# EAGLE design Shield (EAGLE 9.6.0)
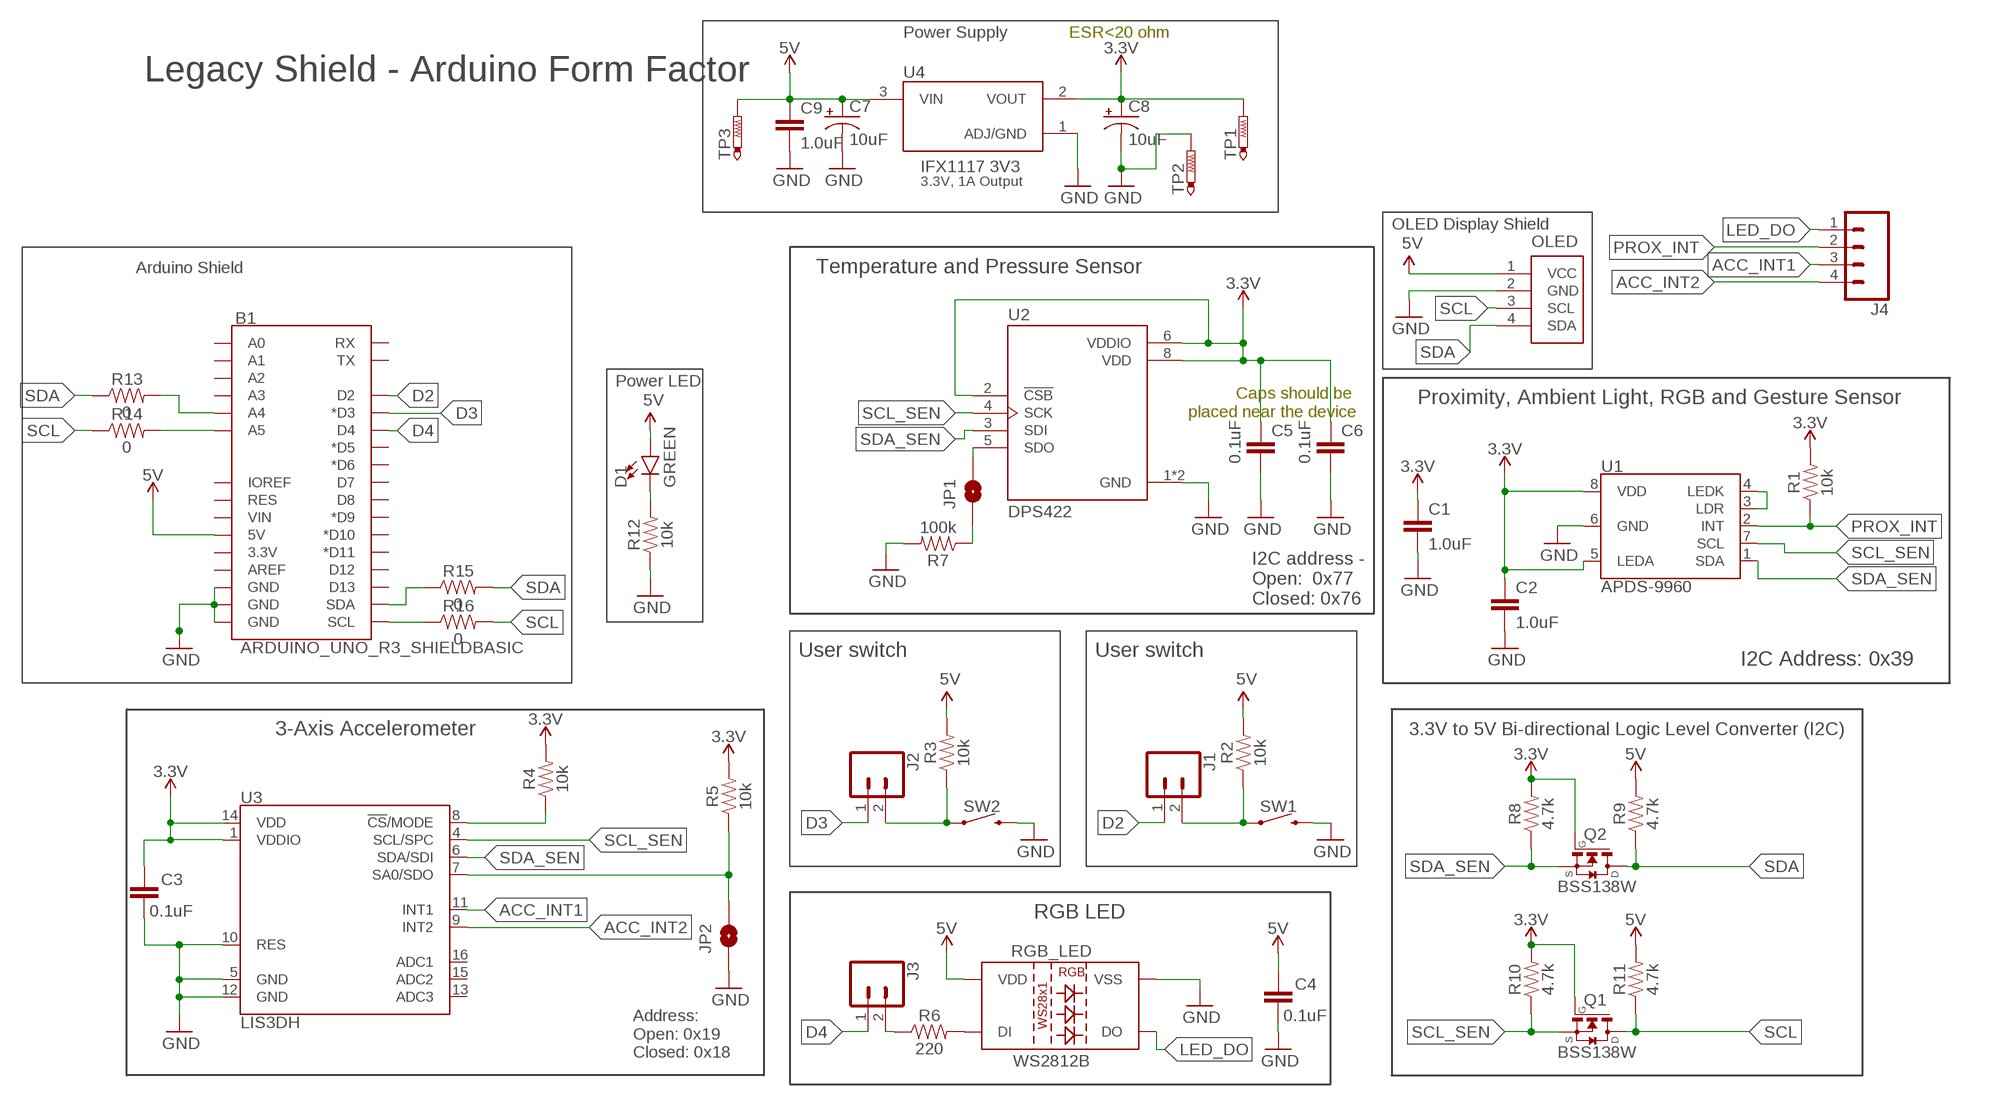
[diagram p0: schematic, sheet 1]

## Parts
B1  ARDUINO_UNO_R3_SHIELDBASIC  [UNO_R3_SHIELD]
C1  1.0uF  1.0UF-16V-10%(0603)  [0603-CAP]
C2  1.0uF  1.0UF-16V-10%(0603)  [0603-CAP]
C3  0.1uF  0.1UF-0603-25V-(+80/-20%)  [0603]
C4  0.1uF  0.1UF-0603-25V-(+80/-20%)  [0603]
C5  0.1uF  0.1UF-0603-25V-(+80/-20%)  [0603]
C6  0.1uF  0.1UF-0603-25V-(+80/-20%)  [0603]
C7  10uF  10UF-POLAR-EIA3528-20V-10%(TANT)  [EIA3528]
C8  10uF  10UF-POLAR-EIA3528-20V-10%(TANT)  [EIA3528]
C9  1.0uF  1.0UF-16V-10%(0603)  [0603-CAP]
D1  GREEN  LED-GREEN1206  [LED-1206]
J1  CONN_02  [1X02]
J2  CONN_02  [1X02]
J3  CONN_02  [1X02]
J4  CONN_04  [1X04]
JP1  JUMPER-SMT_2_NO_SILK  [SMT-JUMPER_2_NO_SILK]
JP2  JUMPER-SMT_2_NO_SILK  [SMT-JUMPER_2_NO_SILK]
OLED  OLED_4_PIN  [OLED_4PIN]
Q1  BSS138W  [SOT323-R]
Q2  BSS138W  [SOT323-R]
R1  10k  10KOHM-0603-1/10W-1%  [0603]
R2  10k  10KOHM-0603-1/10W-1%  [0603]
R3  10k  10KOHM-0603-1/10W-1%  [0603]
R4  10k  10KOHM-0603-1/10W-1%  [0603]
R5  10k  10KOHM-0603-1/10W-1%  [0603]
R6  220  220OHM-0603-1/10W-1%  [0603]
R7  100k  100KOHM-0603-1/10W-1%  [0603]
R8  4.7k  4.7KOHM-0603-1/10W-1%  [0603]
R9  4.7k  4.7KOHM-0603-1/10W-1%  [0603]
R10  4.7k  4.7KOHM-0603-1/10W-1%  [0603]
R11  4.7k  4.7KOHM-0603-1/10W-1%  [0603]
R12  10k  10KOHM-0603-1/10W-1%  [0603]
R13  0  0OHM-0603-1/10W-5%  [0603]
R14  0  0OHM-0603-1/10W-5%  [0603]
R15  0  0OHM-0603-1/10W-5%  [0603]
R16  0  0OHM-0603-1/10W-5%  [0603]
RGB_LED  WS2812B  [WS2812B]
SW1  MOMENTARY-SWITCH-SPST-PTH-6.0MM  [TACTILE_SWITCH_PTH_6.0MM]
SW2  MOMENTARY-SWITCH-SPST-PTH-6.0MM  [TACTILE_SWITCH_PTH_6.0MM]
TP1  PTR1TP08R  [TP08R]
TP2  PTR1TP08R  [TP08R]
TP3  PTR1TP08R  [TP08R]
U1  APDS-9960  [APDS-9960]
U2  DPS422  [XDCR_DPS422]
U3  LIS3DH  [LGA-16-3X3]
U4  IFX1117 3V3  AMS1117-3.3  [SOT229P700X180-4N]

## Nets
3.3V: C1.1 C2.1 C3.1 C5.1 C6.1 C8.A(+) Q1.1(G) Q2.1(G) R1.2 R4.2 R5.2 R8.2 R10.2 TP1.TP U1.5(LEDA) U1.8(VDD) U2.2(!CSB) U2.6(VDDIO) U2.8(VDD) U3.1(VDDIO) U3.14(VDD) U4.2(VOUT)
5V: B1.5V C4.1 C7.A(+) C9.1 D1.A OLED.1(VCC) R2.2 R3.2 R9.2 R11.2 RGB_LED.1(VDD) TP3.TP U4.3(VIN)
ACC_INT1: J4.3 U3.11(INT1)
ACC_INT2: J4.4 U3.9(INT2)
D2: B1.D2 J1.1
D3: B1.D3(*D3) J2.1
D4: B1.D4 J3.1
GND: B1.GND@0(GND) B1.GND@1(GND) B1.GND@2(GND) C1.2 C2.2 C3.2 C4.2 C5.2 C6.2 C7.C(-) C8.C(-) C9.2 JP2.1 OLED.2(GND) R7.2 R12.1 RGB_LED.3(VSS) SW1.3 SW2.3 TP2.TP U1.6(GND) U2.1(GND) U2.7(GND) U3.5(GND) U3.10(RES) U3.12(GND) U4.1(ADJ/GND)
LED_DO: J4.1 RGB_LED.2(DO)
N$1: J1.2 R2.1 SW1.1
N$2: J2.2 R3.1 SW2.1
N$3: D1.C R12.2
N$4: JP1.2 U2.5(SDO)
N$5: JP1.1 R7.1
N$6: B1.A4 R13.2
N$7: U1.3(LDR) U1.4(LEDK)
N$8: B1.A5 R14.2
N$9: B1.SDA R15.1
N$10: JP2.2 R5.1 U3.7(SA0/SDO)
N$11: J3.2 R6.1
N$12: B1.SCL R16.1
N$19: R4.1 U3.8(!CS!/MODE)
N$20: R6.2 RGB_LED.4(DI)
PROX_INT: J4.2 R1.1 U1.2(INT)
SCL: OLED.3(SCL) Q1.3(D) R11.1 R14.1 R16.2
SCL_SEN: Q1.2(S) R10.1 U1.7(SCL) U2.4(SCK) U3.4(SCL/SPC)
SDA: OLED.4(SDA) Q2.3(D) R9.1 R13.1 R15.2
SDA_SEN: Q2.2(S) R8.1 U1.1(SDA) U2.3(SDI) U3.6(SDA/SDI)
Unconnected: B1.3.3V B1.A0 B1.A1 B1.A2 B1.A3 B1.AREF B1.D5(*D5) B1.D6(*D6) B1.D7 B1.D8 B1.D9(*D9) B1.D10(*D10) B1.D11(*D11) B1.D12 B1.D13 B1.IOREF B1.RES B1.RX B1.TX B1.VIN U3.13(ADC3) U3.15(ADC2) U3.16(ADC1)

## Notes on the sheet
- Power Supply | ESR<20 ohm
- Legacy Shield - Arduino Form Factor
- 3.3V, 1A Output
- OLED Display Shield
- Arduino Shield | Temperature and Pressure Sensor
- Power LED
- Caps should be 
  placed near the device
- Proximity, Ambient Light, RGB and Gesture Sensor
- I2C address -
  Open:  0x77
  Closed: 0x76
- User switch | User switch
- I2C Address: 0x39
- 3-Axis Accelerometer | 3.3V to 5V Bi-directional Logic Level Converter (I2C)
- RGB LED
- Address:
  Open: 0x19
  Closed: 0x18

## Library data of the parts
B1 = SparkFun-Boards:ARDUINO_UNO_R3_SHIELD: Arduino R3 Shield Footprint Shield form compatible with the Arduino Uno R3. SparkFun Products: MG2639 Cellular Shield <https://www.sparkfun.com/products/13120> MIDI Shield <https://www.sparkfun.com/products/12898> R3 Stackable Headers Kit <https://www.sparkfun.com/products/11417>
C1 C2 C9 = SparkFun-Capacitors:1.0UF-16V-10%(0603): CAP-00868; PROD_ID: CAP-00868
C3-C6 = SparkFun-Capacitors:0.1UF: 0.1µF ceramic capacitors A capacitor is a passive two-terminal electrical component used to store electrical energy temporarily in an electric field.; PROD_ID: CAP-00810
C7 C8 = SparkFun-Capacitors:10UF-POLAR: 10.0µF polarized capacitors A capacitor is a passive two-terminal electrical component used to store electrical energy temporarily in an electric field.; PROD_ID: CAP-08063
D1 = SparkFun-LED:LED-GREEN: Green SMD LED Used in manufacturing of various products at SparkFun Packages: 0603 - SMD 0603 package [Product Link] <http://www.futureelectronics.com/en/technologies/semiconductors/optoelectronics/leds/Pages/9894312-LTST-C190GKT.aspx?CrossPart=HSMG-C190&IM=0> LilyPad 1206 - SMD1206 LilyPad package [Product Link] <http://www.futureelectronics.com/en/Technologies/Product.aspx?ProductID=IN150NGHARVATEKCORPORATION2049943&IM=0> 1206 - SMD1206 package [Product Link] <http://www.futureelectronics.com/en/technologies/semiconductors/optoelectronics/leds/Pages/8315665-LTST-C150KGKT.aspx?IM=0> 1206 Bottom Mount -SMD 1206 Bottom Mount [Product Link] <http://www.digikey.com/product-detail/en/lite-on-inc/LTST-C230KGKT/160-1456-1-ND/386854> SparkFun Products: Pro Mini 328 -5V <https://www.sparkfun.com/products/821> RedBoard <https://www.sparkfun.com/products/12757> MP3 Trigger <https://www.sparkfun.com/products/13720> Makey Makey <https://www.sparkfun.com/products/11076>; PROD_ID: DIO-00862
J1-J3 = SparkFun-Connectors:CONN_02: Multi connection point. Often used as Generic Header-pin footprint for 0.1 inch spaced/style header connections On any of the 0.1 inch spaced packages, you can populate with these: Break Away Headers - Straight <https://www.sparkfun.com/products/116> (PRT-00116) Break Away Male Headers - Right Angle <https://www.sparkfun.com/products/553> (PRT-00553) Female Headers <https://www.sparkfun.com/products/115> (PRT-00115) Break Away Headers - Machine Pin <https://www.sparkfun.com/products/117> (PRT-00117) Break Away Female Headers - Swiss Machine Pin <https://www.sparkfun.com/products/743> (PRT-00743) For SCREWTERMINALS and SPRING TERMINALS visit here: Screw Terimnals on SparkFun.com <https://www.sparkfun.com/search/results?term=Screw+Terminals> (5mm/3.5mm/2.54mm spacing) This device is also useful as a general connection point to wire up your design to another part of your project. Our various solder wires solder well into these plated through hole pads. Hook-Up Wire - Assortment (Stranded, 22 AWG) <https://www.sparkfun.com/products/11375> (PRT-11375) Hook-Up Wire - Assortment (Solid Core, 22 AWG) <https://www.sparkfun.com/products/11367> (PRT-11367) View the entire wire category on our website here <https://www.sparkfun.com/categories/141> Special notes: Molex polarized connector foot print use with: PRT-08233 with associated crimp pins and housings. 2.54_SCREWTERM for use with PRT-10571. 3.5mm Screw Terminal footprints for PRT-08084 5mm Screw Terminal footprints for use with PRT-08432
J4 = SparkFun-Connectors:CONN_04: Multi connection point. Often used as Generic Header-pin footprint for 0.1 inch spaced/style header connections On any of the 0.1 inch spaced packages, you can populate with these: Break Away Headers - Straight <https://www.sparkfun.com/products/116> (PRT-00116) Break Away Male Headers - Right Angle <https://www.sparkfun.com/products/553> (PRT-00553) Female Headers <https://www.sparkfun.com/products/115> (PRT-00115) Break Away Headers - Machine Pin <https://www.sparkfun.com/products/117> (PRT-00117) Break Away Female Headers - Swiss Machine Pin <https://www.sparkfun.com/products/743> (PRT-00743) For SCREWTERMINALS and SPRING TERMINALS visit here: Screw Terimnals on SparkFun.com <https://www.sparkfun.com/search/results?term=Screw+Terminals> (5mm/3.5mm/2.54mm spacing) This device is also useful as a general connection point to wire up your design to another part of your project. Our various solder wires solder well into these plated through hole pads. Hook-Up Wire - Assortment (Stranded, 22 AWG) <https://www.sparkfun.com/products/11375> (PRT-11375) Hook-Up Wire - Assortment (Solid Core, 22 AWG) <https://www.sparkfun.com/products/11367> (PRT-11367) View the entire wire category on our website here <https://www.sparkfun.com/categories/141> Special notes: Molex polarized connector foot print use with SKU : PRT-08231 with associated crimp pins and housings. 1MM SMD Version SKU: PRT-10208; PROD_ID: CONN-09696
JP1 JP2 = SparkFun-Jumpers:JUMPER-SMT_2_NO: Normally open jumper This jumper has two pads in close proximity to each other. Apply solder to close the connection. Round pads are easier to solder for beginners, but are a lot larger. SparkFun Product that uses the round pads: SparkFun EL Sequencer <https://www.sparkfun.com/products/12781>
OLED = OLED_4_pin:OLED_4_PIN: This is a 4-pin SSD1306 OLED display module.; DESCRIPTION: 0.96 Inch I2C/IIC 4pin OLED Display Module; MF: Adafruit Industries; PURCHASE_LINK: https://robu.in/product/0-96-inch-i2c-iic-oled-lcd-module-4pin-with-vcc-gnd-blue/
Q1 Q2 = BSS138W:BSS138W: N-Channel MOSFET; DESCRIPTION: N-Channel 60V 280mA (Ta) 500mW (Ta) Surface Mount PG-SOT323-3; DIGI-KEY_PART_NUMBER: BSS138WH6327XTSA1CT-ND; DIGI-KEY_PURCHASE_URL: https://www.digikey.in/product-detail/en/infineon-technologies/BSS138WH6327XTSA1/BSS138WH6327XTSA1CT-ND/5410000; MF: Infineon Technologies; MP: BSS138W; PACKAGE: SOT-323
R1-R5 R12 = SparkFun-Resistors:10KOHM: 10kΩ resistor A resistor is a passive two-terminal electrical component that implements electrical resistance as a circuit element. Resistors act to reduce current flow, and, at the same time, act to lower voltage levels within circuits. - Wikipedia; PROD_ID: RES-00824
R6 = SparkFun-Resistors:220OHM: 220Ω resistor A resistor is a passive two-terminal electrical component that implements electrical resistance as a circuit element. Resistors act to reduce current flow, and, at the same time, act to lower voltage levels within circuits. - Wikipedia; PROD_ID: RES-07861
R7 = SparkFun-Resistors:100KOHM: 100kΩ resistor A resistor is a passive two-terminal electrical component that implements electrical resistance as a circuit element. Resistors act to reduce current flow, and, at the same time, act to lower voltage levels within circuits. - Wikipedia; PROD_ID: RES-07828
R8-R11 = SparkFun-Resistors:4.7KOHM: 4.7kΩ resistor A resistor is a passive two-terminal electrical component that implements electrical resistance as a circuit element. Resistors act to reduce current flow, and, at the same time, act to lower voltage levels within circuits. - Wikipedia; PROD_ID: RES-07857
R13-R16 = SparkFun-Resistors:0OHM: 0Ω resistor A resistor is a passive two-terminal electrical component that implements electrical resistance as a circuit element. Resistors act to reduce current flow, and, at the same time, act to lower voltage levels within circuits. - Wikipedia; PROD_ID: RES-08609
RGB_LED = SparkFun-LED:WS2812B: WS2812B SMD addressable RGB LED 5x5mm SMD LED with built-in controller IC. Color: Red/Green/Blue mC Rating: RGB: 390, 660, 180 mcd Forward Voltage: RGB: 2.0, 3.0, 3.0 V Packages:WS2812B SparkFun Products: Blynk Board - ESP8266 <https://www.sparkfun.com/products/13794>; PROD_ID: DIO-12503
SW1 SW2 = SparkFun-Switches:MOMENTARY-SWITCH-SPST: Momentary Switch (Pushbutton) - SPST Normally-open (NO) SPST momentary switches (buttons, pushbuttons). Variants PTH-12MM - 12mm square, through-hole Momentary Pushbutton Switch - 12mm Square <https://www.sparkfun.com/products/9190> (COM-09190) PTH-6.0MM, PTH-6.0MM-KIT - 6.0mm square, through-hole Mini Pushbutton Switch <https://www.sparkfun.com/products/97> (COM-00097) KIT package intended for soldering kit's - only one side of pads' copper is exposed. PTH-RIGHT-ANGLE-KIT - Right-angle, through-hole Right Angle Tactile Button <https://www.sparkfun.com/products/10791> - Used on SparkFun BigTime Watch Kit <https://www.sparkfun.com/products/11734> SMD-12MM - 12mm square, surface-mount Tactile Button - SMD (12mm) <https://www.sparkfun.com/products/12993> (COM-12993) Used on SparkFun PicoBoard <https://www.sparkfun.com/products/11888> SMD-4.5MM - 4.5mm Square Trackball Switch Used on SparkFun Blackberry Trackballer Breakout <https://www.sparkfun.com/products/13169> SMD-4.6MMX2.8MM - 4.60mm x 2.80mm, surface mount Used on SparkFun SAMD21 Mini Breakout <https://www.sparkfun.com/products/13664> SMD-5.2MM, SMD-5.2-REDUNDANT - 5.2mm square, surface-mount Mini Pushbutton Switch - SMD <https://www.sparkfun.com/products/8720> (COM-08720) Used on Arduino Pro Mini <https://www.sparkfun.com/products/11114> REDUNDANT package connects both switch circuits together SMD-6.0X3.5MM - 6.0 x 3.5mm, surface mount Momentary Reset Switch SMD <https://www.sparkfun.com/products/8229> (COM-08229) SMD-6.2MM-TALL - 6.2mm square, surface mount Tactile Button - SMD (6mm) <https://www.sparkfun.com/products/12992> Used on SparkFun Digital Sandbox <https://www.sparkfun.com/products/12651> SMD-RIGHT-ANGLE - Right-angle, surface mount Used on SparkFun Block for Intel® Edison - Arduino <https://www.sparkfun.com/products/13036>; PROD_ID: SWCH-08441; SF_SKU: COM-00097
TP1-TP3 = testpad:PTR1: TEST PIN
U1 = APDS-9960:APDS-9960: Avago APDS-9960 Digital Proximity, Ambient Light, RGB, and Gesture Sensor. The APDS-9960 offers ambient light and color measuring, proximity detection, and touchless gesture sensing. It features UV and IR blocking filters, four separate diodes sensitive to different directions, and an I2C compatible interface. Datasheet <https://cdn.sparkfun.com/datasheets/Sensors/Proximity/apds9960.pdf> SparkFun Products SparkFun RGB and Gesture Sensor - APDS-9960 <https://www.sparkfun.com/products/12787> (SEN-12787); AVAILABILITY: Unavailable; DESCRIPTION: Digital Ambient Light and Proximity Sensor 8-Pin SMD T/R; DIGI-KEY_PART_NUMBER: 516-3480-1-ND; DIGI-KEY_PURCHASE_LINK: https://www.digikey.in/product-detail/en/broadcom-limited/APDS-9960/516-3480-1-ND/6677150; MF: Broadcom Limited; MP: APDS-9960; PACKAGE: SMD-8 Broadcom; PRICE: None
U2 = DPS422:DPS422: N/A; AVAILABILITY: Unavailable; DESCRIPTION: Pressure Sensor 4.35PSI ~ 17.4PSI _30kPa ~ 120kPa_ Vented Gauge 24 b 8-WLGA; DIGI-KEY_PART_NUMBER: DPS422XTSA1CT-ND; DIGI-KEY_PURCHASE_LINK: https://www.digikey.in/product-detail/en/infineon-technologies/DPS422XTSA1/DPS422XTSA1CT-ND/9384616; MF: Infineon Technologies; MP: DPS422; PACKAGE: WLGA-8 Infineon; PRICE: None
U3 = SparkFun-Sensors:LIS3DH: ST Microelectronics LIS3DH 3-Axis ±2/4/8/16g SPI/I2C Accelerometer The LIS3DH is a three axis MEMS linear accelerometer in the "nano" family. It has a digital I2C/SPI serial interface which makes it ideal for using in embedded applications. The device also features ultra low-power operational modes that allow advanced power saving and smart sleep to wake-up functions, built in detections with interrupts, and auxiliary ADC inputs Datasheet-XXXX <http://www.sparkfun.com/datasheets/Sensors/Accelerometer/LIS3DH.pdf> SparkFun Products SparkFun Triple Axis Accelerometer Breakout - LIS3DH <https://www.sparkfun.com/products/10345> (SEN-XXXXX) Triple Axis Accelerometer - LIS3DH <https://www.sparkfun.com/products/9755> (SEN-XXXXX); PROD_ID: IC-13419; SF_ID: N/A
U4 = AMS1117-3.3:AMS1117-3.3: Sot223/Pkg 1-Amp 3.3-Volt Low Drop Out Voltage Regulatator; AVAILABILITY: Unavailable; DESCRIPTION: IC REG LINEAR 3.3V 1A SOT223-4; DIGI-KEY_PART_NUMBER: IFX1117MEV33HTMA1CT-ND; DIGI-KEY_PURCHASE_URL: https://www.digikey.in/product-detail/en/infineon-technologies/IFX1117MEV33HTMA1/IFX1117MEV33HTMA1CT-ND/3929253; MF: Infineon Technologies; MP: IFX1117; PACKAGE: SOT223-4; PRICE: None

## Board
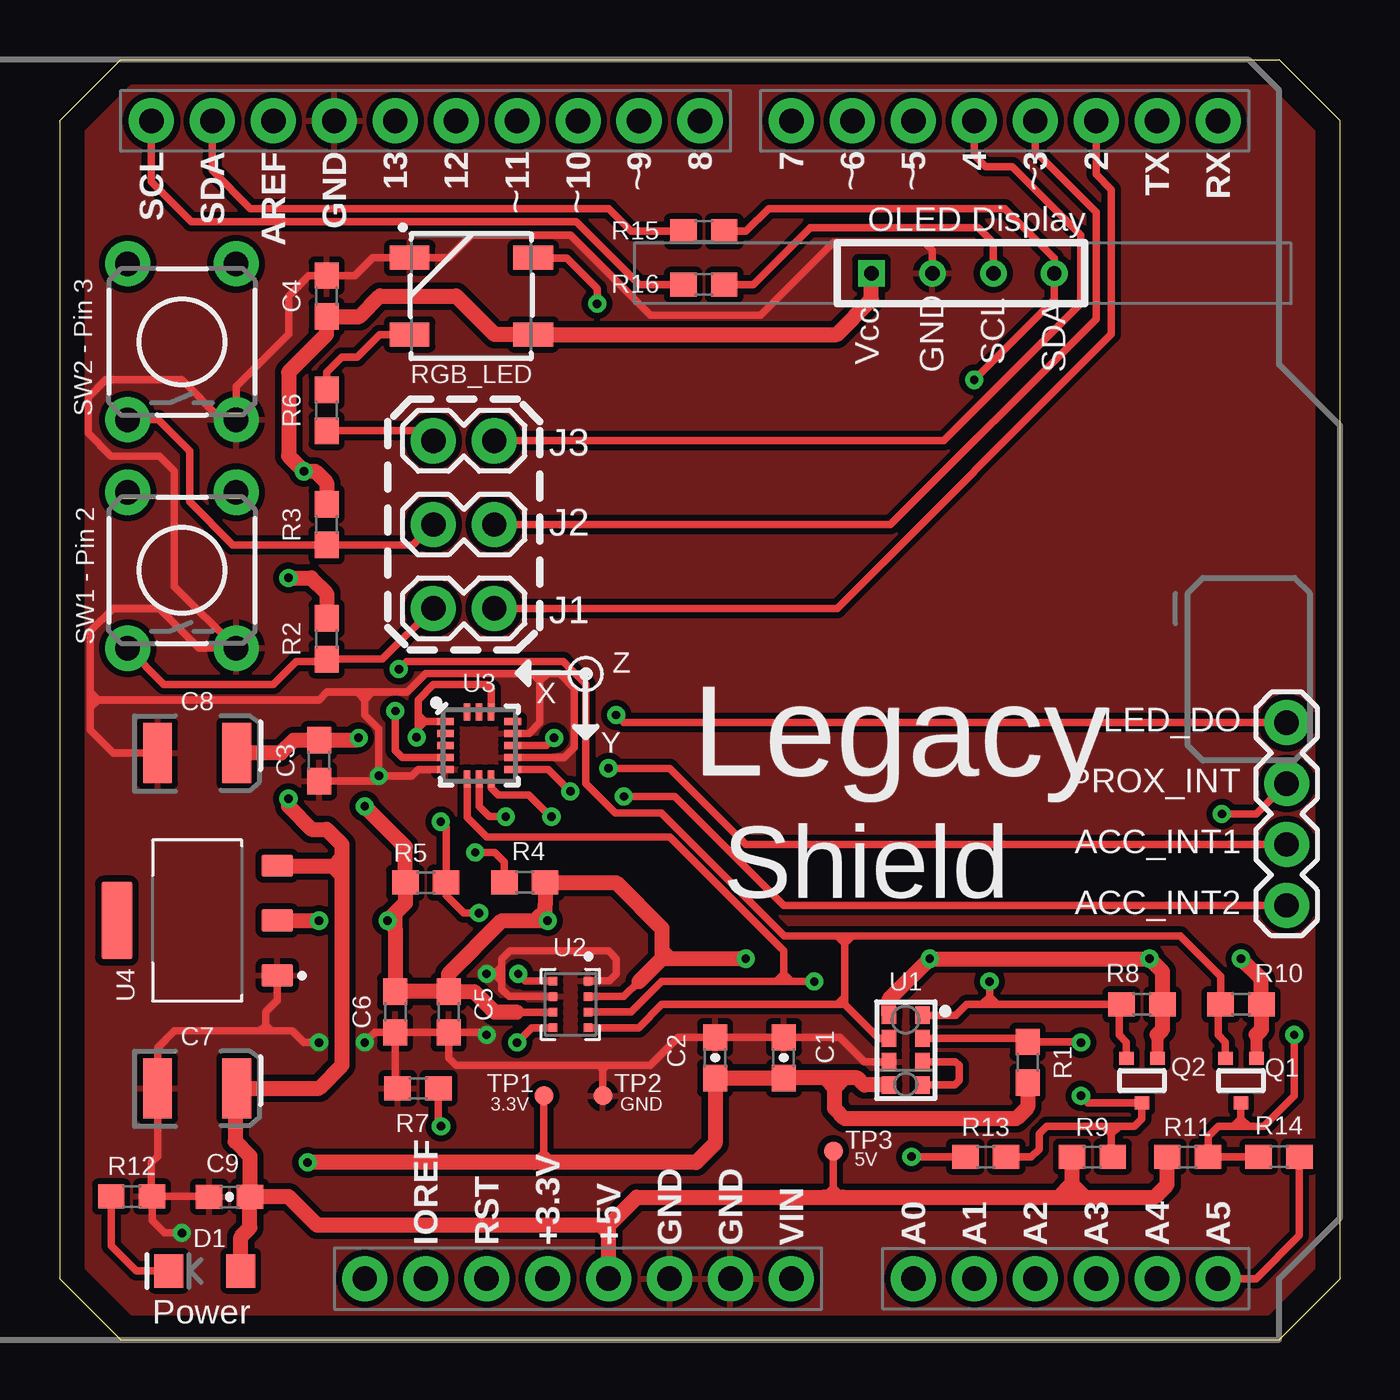
[diagram p1: board, top side]
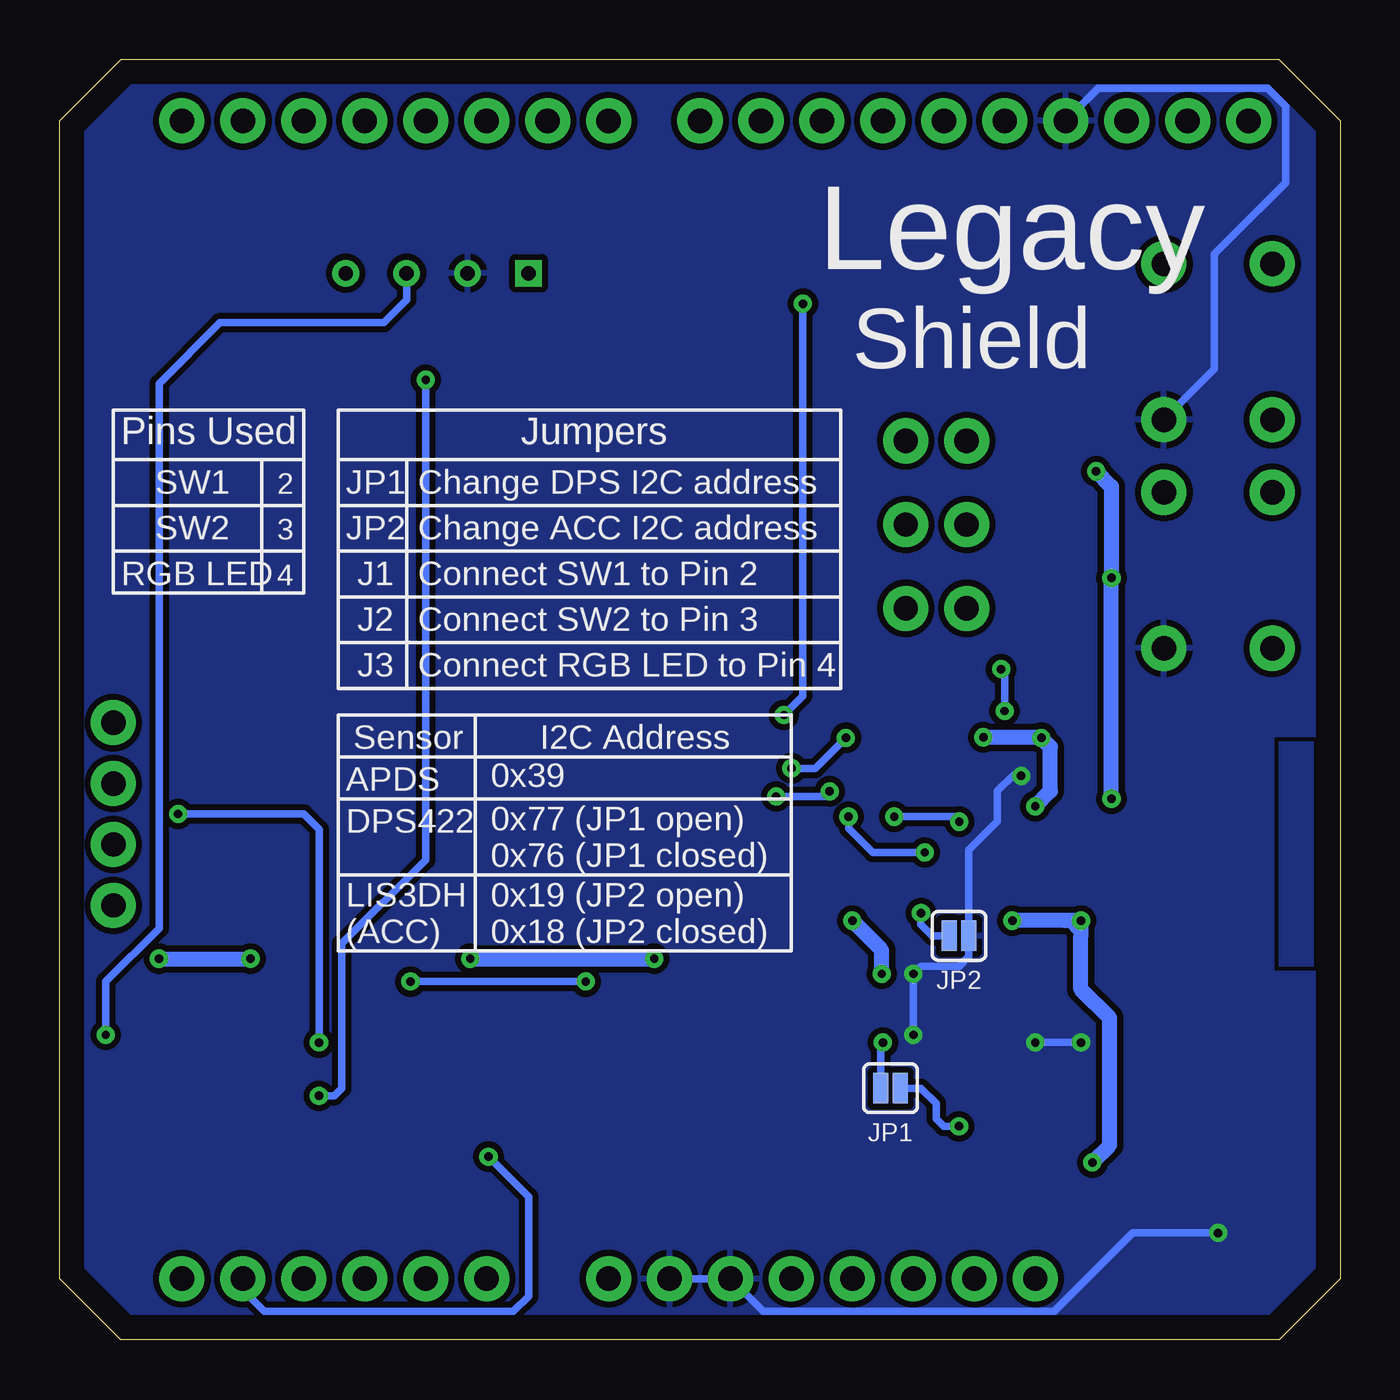
[diagram p2: board, bottom side, seen from below]

Size 53.34 x 53.34 mm. Coordinates in mm from the lower left corner, seen from the top.
Outline: 0,50.8 0,2.54 2.54,0 50.8,0 53.34,2.54 53.34,50.8 50.8,53.34 2.54,53.34 0,50.8
Copper layers (1*16): Top 0.035mm / dielectric 1.5mm / Bottom 0.035mm
Design rules "default *": minimum track width 6mil, minimum drill 0.35mm, track to track 6mil, track to pad 6mil, pad to pad 6mil, via to via 6mil, smd to smd 6mil, copper to edge 40mil, drill to drill 6mil, minimum pad ring 10mil, minimum via ring 8mil, stop-mask expansion 4mil, vias tented up to drill 15mil, thermal gap 10mil

### Footprints (pad centres in the part's own frame; a part is rotated, then mirrored left to right if it is on the bottom)
UNO_R3_SHIELD = drill 1.016 pad 1.88: 3.3V 24.13,-2.54; 5V 24.13,0; A0 24.13,12.7; A1 24.13,15.24; A2 24.13,17.78; A3 24.13,20.32; A4 24.13,22.86; A5 24.13,25.4; AREF -24.13,-13.97; D2 -24.13,20.32; D3 -24.13,17.78; D4 -24.13,15.24; D5 -24.13,12.7; D6 -24.13,10.16; D7 -24.13,7.62; D8 -24.13,3.81; D9 -24.13,1.27; D10 -24.13,-1.27; D11 -24.13,-3.81; D12 -24.13,-6.35; D13 -24.13,-8.89; GND@0 24.13,2.54; GND@1 24.13,5.08; GND@2 -24.13,-11.43; IOREF 24.13,-7.62; NC 24.13,-10.16; RES 24.13,-5.08; RX -24.13,25.4; SCL -24.13,-19.05; SDA -24.13,-16.51; TX -24.13,22.86; VIN 24.13,7.62
0603-CAP = smd 1.1 x 1: 1 -0.85,0; 2 0.85,0
0603 = smd 1.1 x 1: 1 -0.85,0; 2 0.85,0
EIA3528 = smd 1.2 x 2.5: A 1.65,0; C -1.65,0
LED-1206 = smd 1.2 x 1.4: A -1.5,0; C 1.5,0
1X02 = drill 1.016 pad 1.88: 1 0,0; 2 2.54,0
1X04 = drill 1.016 pad 1.88: 1 0,0; 2 2.54,0; 3 5.08,0; 4 7.62,0
SMT-JUMPER_2_NO_SILK = smd 0.635 x 1.27: 1 -0.406,0; 2 0.406,0
OLED_4PIN = drill 0.6 square: 1 -3.81,-1.27 | drill 0.6: 2 -1.27,-1.27; 3 1.27,-1.27; 4 3.81,-1.27
SOT323-R = smd 0.6 x 0.55: 1 -0.65,-0.925; 2 0.65,-0.925; 3 0,0.925
WS2812B = smd 1.651 x 1: 1 2.577,-1.6; 2 2.577,1.6; 3 -2.577,1.6; 4 -2.577,-1.6
TACTILE_SWITCH_PTH_6.0MM = drill 1.016 pad 1.88: 1 -3.251,2.261; 2 3.251,2.261; 3 -3.251,-2.261; 4 3.251,-2.261
TP08R = smd 0.8 x 0.8: TP 0,0
APDS-9960 = smd 0.6 x 0.72: 1 0.7,1.455; 2 0.7,0.485; 3 0.7,-0.485; 4 0.7,-1.455; 5 -0.7,-1.455; 6 -0.7,-0.485; 7 -0.7,0.485; 8 -0.7,1.455
XDCR_DPS422 = smd 0.35 x 0.35: 1 -0.975,0.725; 2 -0.325,0.725; 3 0.325,0.725; 4 0.975,0.725; 5 0.975,-0.725; 6 0.325,-0.725; 7 -0.325,-0.725; 8 -0.975,-0.725
LGA-16-3X3 = smd 0.7 x 0.28: 1 -1.4,1; 2 -1.4,0.5; 3 -1.4,0; 4 -1.4,-0.5; 5 -1.4,-1; 9 1.4,-1; 10 1.4,-0.5; 11 1.4,0; 12 1.4,0.5; 13 1.4,1 | smd 0.28 x 0.7: 6 -0.5,-1.4; 7 0,-1.4; 8 0.5,-1.4; 14 0.5,1.4; 15 0,1.4; 16 -0.5,1.4
SOT229P700X180-4N = smd 0.93 x 1.31: 1 -2.29,-3.345; 2 0,-3.345; 3 2.29,-3.345 | smd 3.24 x 1.31: 4 0,3.345

### Placement (x,y rotation side)
B1  22.86,26.67 270 top
C1  30.16,11.75 90 top
C2  27.3,11.75 90 top
C3  10.79,24.13 270 top
C4  11.11,43.5 90 top
C5  16.19,13.65 270 top
C6  13.97,13.65 270 top
C7  5.71,10.48 0 top
C8  5.71,24.45 0 top
C9  7.06,5.95 180 top
D1  6.03,2.86 180 top
J1  18.1,30.48 180 top
J2  18.1,33.97 180 top
J3  18.1,37.47 180 top
J4  51.12,25.72 270 top
JP1  18.73,10.48 180 bottom
JP2  15.87,16.83 180 bottom
OLED  37.62,45.72 0 top
Q1  49.21,10.79 180 top
Q2  45.09,10.79 180 top
R1  40.32,11.56 270 top
R2  11.11,29.21 90 top
R3  11.11,33.97 90 top
R4  19.37,19.05 0 top
R5  15.24,19.05 180 top
R6  11.11,38.73 90 top
R7  14.92,10.48 180 top
R8  45.09,13.97 0 top
R9  43.02,7.62 180 top
R10  49.21,13.97 0 top
R11  46.99,7.62 180 top
R12  2.98,5.97 180 top
R13  38.58,7.62 180 top
R14  50.8,7.62 0 top
R15  26.83,46.2 0 top
R16  26.83,43.97 0 top
RGB_LED  17.15,43.5 0 top
SW1  5.08,32.07 90 top
SW2  5.08,41.59 90 top
TP1  20.16,10.16 0 top
TP2  22.62,10.16 0 top
TP3  32.23,7.86 0 top
U1  35.24,12.07 0 top
U2  21.27,13.97 270 top
U3  17.46,24.77 0 top
U4  5.71,17.46 90 top

### Tracks (layer width: path | path; a pad name or v marks a point on that pad's centre or on a via)
3.3V  (via drill 0.35)
  Top 0.305: U3.14 17.96,27.12 17.78,27.31 15.56,27.31 14.92,26.67 14.92,26.04 | U2.6 19.06,13.64 19.05,13.65 | U2.2 23.5,14.29 24.13,14.92 | U2.8 19.39,14.95 v19.1,15.24 | 20.22,18.1 19.68,17.57 19.68,17.46 | v14.86,25.11 14.92,25.17 14.92,25.5 | 14.92,25.5 14.92,25.72 | 14.92,25.72 14.92,26.04 | U3.1 15.19,25.77 | 15.19,25.77 14.97,25.77 14.92,25.72 | 15.19,25.77 14.92,26.04 | 15.19,25.77 14.92,25.5 | TP1.TP 20.16,7.78 | 20.16,7.78 20.16,7.46 20.08,7.38 | 19.76,7.38 20.16,7.78 | 20.16,7.78 20.48,7.46 20.48,7.38
  Top 0.508: 45.72,12.7 45.72,11.74 Q2.1 | 49.85,12.7 49.85,11.74 Q1.1
  Top 0.635: 32.28,10.9 31.86,10.9 | 31.86,10.9 C1.1 C2.1 27.3,8.18 26.51,7.38 20.48,7.38 20.08,7.38 19.76,7.38 v10.32,7.38 | R1.2 40.32,9.68 39.85,9.21 32.7,9.21 32.28,9.63 32.28,10.48 | 32.28,10.48 32.28,10.9 | U1.5 33.52,10.61 33.23,10.9 32.7,10.9 | 32.7,10.9 32.28,10.9 | 31.86,10.9 32.28,10.48 | 32.28,10.48 32.7,10.9 | 45.72,12.7 45.93,12.92 R8.2 45.93,15.34 v45.4,15.88 v36.24,15.88 34.54,14.17 U1.8 | 49.85,12.7 50.06,12.92 R10.2 50.06,15.03 v49.21,15.88 | C5.1 17.25,14.5 18.1,13.65 19.05,13.65 | v28.57,15.88 25.4,15.88 | 25.4,15.88 25.08,15.88 | 24.13,14.92 25.08,15.88 | C8.A 9.21,24.45 9.74,24.98 C3.1 12.34,24.98 v12.45,25.08 | C5.1 C6.1 13.97,17.14 | U4.2 v10.79,17.46 | 13.97,17.78 14.39,18.2 R5.2 14.39,20.54 v12.7,22.22 | 13.97,17.78 13.81,17.62 | 13.81,17.62 v13.65,17.46 13.97,17.14 | 13.97,17.14 13.97,17.46 | 13.97,17.46 13.81,17.62 | 13.97,17.46 13.97,17.78 | 25.08,16.19 25.08,17.14 23.18,19.05 R4.2 20.22,18.1 20.22,17.57 v20.32,17.46 19.68,17.46 18.41,17.46 16.19,15.24 C5.1 | 25.08,16.19 25.08,15.88 | 25.08,16.19 25.4,15.88
  Bottom 0.305: 10.79,16.83 11.43,17.46
  Bottom 0.635: v49.21,15.88 v45.4,15.88 | v36.24,15.88 v28.57,15.88 | v13.65,17.46 11.43,17.46 v10.79,17.46 10.79,16.83 10.79,14.61 9.6,13.41 9.6,8.1 v10.32,7.38 | v19.1,15.24 19.1,16.24 v20.32,17.46 | v12.7,22.22 12.07,22.86 12.07,24.7 v12.45,25.08 12.47,25.11 v14.86,25.11
5V  (via drill 0.35)
  Top 0.305: TP3.TP 32.23,6.33 | 32.23,6.33 32.23,5.93 | 32.23,6.33 31.83,5.93 | 32.23,6.33 32.62,5.93
  Top 0.635: B1.5V 22.86,4.45 | 22.86,4.45 22.86,4.76 | 22.86,4.76 22.54,4.76 | 22.86,4.76 24.03,5.93 31.83,5.93 32.23,5.93 32.62,5.93 41.59,5.93 | 22.54,4.76 22.86,4.45 | v9.52,31.75 10.48,31.75 11.11,31.11 R2.2 | R3.2 11.11,35.72 10.64,36.2 v10.16,36.2 9.52,36.83 9.52,40.32 11.11,41.91 C4.1 12.48,42.65 13.34,43.5 16.51,43.5 18.11,41.9 RGB_LED.1 32.37,41.9 33.81,43.34 OLED.1 | v9.52,22.54 9.52,22.22 10.48,21.27 11.11,21.27 11.75,20.64 11.75,20.07 | 11.75,20.07 11.75,19.68 | 11.75,19.68 11.75,19.37 | 11.75,19.37 11.75,11.43 10.79,10.48 C7.A 7.3,10.42 7.3,8.25 7.91,7.64 C9.1 | U4.3 11.43,19.75 | 11.43,19.75 11.68,19.75 11.75,19.68 | 11.43,19.75 11.75,20.07 | 11.43,19.75 11.43,19.68 11.75,19.37 | R11.2 46.14,6.45 45.62,5.93 42.7,5.93 | 41.59,5.93 42.23,5.93 | 42.23,5.93 42.7,5.93 | R9.2 42.17,6.46 | 42.17,6.46 42.17,5.99 42.23,5.93 | 42.7,5.93 42.17,6.46 | 42.17,6.46 42.12,6.46 41.59,5.93 | C9.1 9.52,5.95 10.72,4.76 22.54,4.76 | D1.A 7.53,4.28 7.91,4.66 C9.1
  Bottom 0.635: v9.52,22.54 v9.52,31.75 9.52,35.56 v10.16,36.2
ACC_INT1  (via drill 0.35)
  Top 0.305: J4.3 28.57,20.64 25.4,23.81 v22.86,23.81 | v20.59,25.08 20.27,24.77 U3.11
  Bottom 0.305: v22.86,23.81 21.86,23.81 v20.59,25.08
ACC_INT2  (via drill 0.35)
  Top 0.305: J4.4 30.16,18.1 25.62,22.64 v23.49,22.64 | v21.27,22.85 20.35,23.77 U3.9
  Bottom 0.305: v23.49,22.64 21.48,22.64 v21.27,22.85
D2
  Top 0.305: J1.1 32.38,30.48 43.82,41.91 43.82,47.94 43.18,48.58 B1.D2
D3
  Top 0.305: B1.D3 40.64,49.53 43.18,46.99 43.18,42.55 34.61,33.97 J2.1
D4
  Top 0.305: J3.1 36.83,37.47 42.54,43.18 42.54,46.04 39.69,48.9 38.58,48.9 38.1,49.37 B1.D4
GND  (via drill 0.35)
  Top 0.305: U3.5 14.92,23.77 14.65,23.5 v13.29,23.5 | v13.29,23.5 13.07,23.28 C3.2 | U3.10 21.01,24.27 21.43,24.69 21.43,27.15 20.82,27.76 20.32,27.76 | U3.12 19.55,25.27 20,25.72 20,27.45 | 20.32,27.76 20,27.76 | 20,27.76 19.68,27.76 | 19.68,27.76 15.24,27.76 14.46,26.99 13.02,26.99 | 20,27.45 20,27.76 | 20,27.45 20.32,27.76 | 20,27.45 19.68,27.76 | U2.1 22.88,14.95 23.18,15.24 23.18,15.88 22.86,16.19 18.73,16.19 18.41,15.88 18.41,15.56 | 18.41,15.56 18.41,15.24 | 18.41,15.24 18.41,14.92 | 18.41,14.92 18.41,14.61 18.73,14.29 U2.7 | U1.6 33.51,11.58 32.49,12.6 C1.2 C2.2 25.77,12.6 24.61,11.43 22.78,11.43 | C6.2 C5.2 | R7.2 13.97,10.58 C6.2 | SW2.3 7.34,38.42 | 7.34,38.42 7.34,39.73 9.52,41.91 9.52,43.5 10.37,44.35 C4.2 12.28,44.35 13.03,45.1 RGB_LED.3 16.21,45.1 17.15,46.04 21.27,46.04 24.61,42.7 29.21,42.7 32.23,45.72 36.04,45.72 36.35,45.4 OLED.2 | 7.34,38.42 6.67,38.42 5.08,40.01 1.91,40.01 1.17,39.27 1.17,37.78 2.12,36.83 4.13,36.83 4.76,36.2 4.76,31.39 SW1.3 5.79,28.82 4.13,30.48 2.22,30.48 1.27,29.53 1.27,26.99 | C8.C 2.22,24.45 1.27,25.4 1.27,26.35 | 1.27,26.35 1.27,26.67 | 1.27,26.67 1.27,26.99 | 18.41,15.24 18.1,15.24 | C6.2 13.12,12.8 v12.7,12.38 | 1.59,26.67 1.27,26.67 | 1.59,26.67 1.27,26.99 | 1.27,26.35 1.59,26.67 | 18.1,15.24 18.41,15.56 | v17.78,15.24 18.1,15.24 | 18.1,15.24 18.41,14.92 | C5.2 16.19,11.75 16.51,11.43 22.46,11.43 | 22.78,11.43 22.62,11.43 | 22.62,11.43 22.46,11.43 | C5.2 17.68,12.8 v17.78,12.7 | v13.29,23.5 13.29,25.45 12.7,26.04 12.7,26.67 | 12.7,26.99 12.7,26.67 | 12.7,26.99 13.02,26.99 | 12.38,26.99 11.11,26.99 10.79,26.67 1.59,26.67 | 12.38,26.99 12.7,26.99 | 12.7,26.67 13.02,26.99
  Top 0.305: 12.7,26.67 12.38,26.99 | R12.1 3.81,5.99 3.81,7.38 4.07,7.64 C7.C 4.07,12.16 4.76,12.86 8.33,12.86 | R12.1 6.2,5.97 C9.2 | v5.08,4.45 4.37,4.45 3.83,4.98 R12.1 | 8.33,12.86 8.57,12.86 | 8.57,12.86 8.81,12.86 | 8.81,12.86 9.68,12.86 10.16,12.38 v10.79,12.38 | U4.1 9.06,14.14 8.57,13.65 8.57,13.1 | 8.57,12.86 8.57,13.1 | 8.57,13.1 8.81,12.86 | 8.57,13.1 8.33,12.86 | TP2.TP 22.62,11.27 | 22.62,11.43 22.62,11.27 | 22.62,11.27 22.46,11.43 | 22.62,11.27 22.78,11.43
  Bottom 0.305: v5.08,4.45 8.63,4.45 11.91,1.17 24.03,1.17 B1.GND@0 B1.GND@1 | v12.7,12.38 v10.79,12.38 | B1.GND@2 10.07,52.16 3.01,52.16 2.26,51.4 2.26,48.23 5.24,45.24 5.24,40.44 SW2.3 | v17.78,12.7 v17.78,15.24 17.46,15.56 15.87,15.56 15.47,15.96 JP2.1 15.47,20.41 14.29,21.59 14.29,22.86 13.6,23.54 13.34,23.54 v13.29,23.5
  pour Top (isolate 0.254): 2.54,53.34 0,50.8 0,2.54 2.54,0 50.8,0 53.34,2.54 53.34,50.8 50.8,53.34
  pour Bottom (isolate 0.254): 50.8,53.34 53.34,50.8 53.34,2.54 50.8,0 2.54,0 0,2.54 0,20.26 0.9,20.26 0.9,15.35 2.75,15.35 2.75,25.13 0.9,25.13 0.9,20.32 0,20.32 0,50.8 2.54,53.34
LED_DO  (via drill 0.35)
  Top 0.305: RGB_LED.2 19.73,45.09 21.11,45.09 22.38,43.81 v22.38,43.18 | v23.18,26.04 23.49,25.72 J4.1
  Bottom 0.305: v23.18,26.04 22.38,26.83 v22.38,43.18
N$1
  Top 0.305: SW1.1 4.33,27.31 8.89,27.31 9.84,28.26 11.01,28.26 R2.1 13.44,28.36 J1.2
N$2
  Top 0.305: J2.2 14.71,33.12 R3.1 7.2,33.12 5.4,34.92 5.4,37.03 4.09,38.34 SW2.1
N$3
  Top 0.305: D1.C 3.18,2.86 2.13,3.9 R12.2
N$4  (via drill 0.35)
  Top 0.305: U2.5 19.66,13 v19.05,12.38
  Bottom 0.305: v19.05,12.38 19.14,12.29 JP1.2
N$5  (via drill 0.35)
  Top 0.305: v15.87,8.89 15.77,8.99 R7.1
  Bottom 0.305: JP1.1 17.46,10.48 16.83,9.84 16.83,9.21 16.51,8.89 v15.87,8.89
N$6  (via drill 0.35)
  Top 0.305: v35.48,7.62 R13.2
  Bottom 0.305: B1.A4 45.72,2.06 44.82,1.17 34.45,1.17 33.81,1.8 33.81,5.95 v35.48,7.62
N$7
  Top 0.305: U1.3 37.32,11.58 37.46,11.43 37.46,10.79 37.28,10.61 U1.4
N$8
  Top 0.305: B1.A5 49.85,2.54 51.65,4.34 R14.2
N$9
  Top 0.305: B1.SDA 6.35,48.74 7.94,47.15 22.86,47.15 23.81,46.2 R15.1
N$10  (via drill 0.35)
  Top 0.305: U3.7 17.46,22.22 17.89,21.8 v18.57,21.8 | v15.87,21.58 16.09,21.36 R5.1 16.09,18.52 16.83,17.78 v17.46,17.78
  Bottom 0.305: v15.87,21.58 16.08,21.8 v18.57,21.8 | JP2.2 16.99,16.83 17.46,17.3 v17.46,17.78
N$11
  Top 0.305: R6.1 15.14,37.89 J3.2
N$12
  Top 0.305: R16.1 24.13,43.97 21.51,46.59 5.48,46.59 3.81,48.26 B1.SCL
N$19  (via drill 0.35)
  Top 0.305: U3.8 17.96,23 18.26,22.7 19.53,22.7 20.43,21.8 v20.48,21.8 | v17.3,20.31 18.11,20.31 18.52,19.9 R4.1
  Bottom 0.305: v20.48,21.8 20.48,21.31 19.48,20.31 v17.3,20.31
N$20
  Top 0.305: RGB_LED.4 13.32,41.9 12.38,40.96 11.75,40.96 11.11,40.32 R6.2
PROX_INT  (via drill 0.35)
  Top 0.203: 40.18,12.55 R1.1
  Top 0.305: U1.2 40.18,12.55 | R1.1 42.52,12.41 v42.54,12.38 | v48.42,21.91 49.85,21.91 J4.2
  Bottom 0.305: v42.54,12.38 42.54,21.27 43.18,21.91 v48.42,21.91
SCL  (via drill 0.35)
  Top 0.305: R14.1 R11.1 47.84,8.47 48.26,8.89 48.9,8.89 | OLED.3 38.89,45.72 38.26,46.36 31.27,46.36 28.89,43.97 R16.2 | v51.43,12.7 51.43,10.16 50.16,8.89 49.53,8.89 | 48.9,8.89 49.21,8.89 | 49.21,8.89 49.53,8.89 | Q1.3 49.21,9.21 | 49.21,8.89 49.21,9.21 | 49.21,9.21 48.9,8.89 | 49.21,9.21 49.53,8.89
  Bottom 0.305: v51.43,12.7 51.43,14.92 49.21,17.14 49.21,39.85 46.67,42.39 39.85,42.39 38.89,43.34 OLED.3
SCL_SEN  (via drill 0.35)
  Top 0.203: 48.26,13.87 R10.1
  Top 0.305: Q1.2 48.56,12.4 48.26,12.7 48.26,13.87 | U1.7 34.12,12.55 32.7,13.97 | R10.1 48.36,15.14 46.67,16.83 33.02,16.83 | 32.38,16.83 30.17,16.83 25.05,21.96 23.13,21.96 21.91,23.18 21.91,27.32 20.97,28.26 14.45,28.26 14.13,27.95 v14.12,27.95 | 32.38,16.83 32.7,16.83 | 32.7,16.83 33.02,16.83 | U2.4 24.11,13 25.08,13.97 32.38,13.97 | 32.7,13.97 32.7,14.29 | 32.7,14.29 32.7,16.51 | 32.7,16.51 32.7,16.83 | 32.38,16.83 32.7,16.51 | 32.7,16.51 33.02,16.83 | U3.4 14.26,24.27 13.98,24.55 v13.98,26.2 | 32.38,13.97 32.7,13.97 | 32.38,13.97 32.7,14.29
  Bottom 0.305: v13.98,26.2 13.98,27.8 v14.12,27.95
SDA  (via drill 0.35)
  Top 0.305: v42.54,10.16 42.84,9.87 Q2.3 45.09,9.21 44.77,8.89 44.13,8.89 | v38.1,40.01 41.43,43.34 OLED.4 41.43,45.07 39.36,47.14 29.53,47.14 28.58,46.2 R15.2 | R13.1 40.48,7.62 40.8,7.94 40.8,8.57 41.12,8.89 43.5,8.89 | 43.5,8.89 43.82,8.89 | 43.82,8.89 44.13,8.89 | R9.1 43.82,7.68 43.82,8.57 | 43.82,8.89 43.82,8.57 | 43.82,8.57 44.13,8.89 | 43.82,8.57 43.5,8.89
  Bottom 0.305: v38.1,40.01 38.1,20 41.59,16.51 41.59,10.48 41.91,10.16 v42.54,10.16
SDA_SEN  (via drill 0.35)
  Top 0.203: 44.13,13.87 R8.1
  Top 0.305: Q2.2 44.43,12.4 44.13,12.7 44.13,13.87 | U1.1 37.33,13.52 37.78,13.97 38.42,13.97 | 38.42,13.97 38.73,13.97 | 38.73,13.97 39.05,13.97 | 39.05,13.97 R8.1 | U2.3 22.01,13.65 23.81,13.65 25.08,14.92 29.85,14.92 | 29.85,14.92 30.16,14.92 | 30.16,14.92 30.48,14.92 | 30.48,14.92 v31.43,14.92 | v38.73,14.92 38.73,14.29 | 38.73,13.97 38.73,14.29 | 38.73,14.29 38.42,13.97 | 38.73,14.29 39.05,13.97 | U3.6 16.96,21.77 17.78,20.96 25.4,20.96 30.16,16.19 30.16,15.24 | 30.16,14.92 30.16,15.24 | 30.16,15.24 30.48,14.92 | 30.16,15.24 29.85,14.92
  Bottom 0.305: v31.43,14.92 v38.73,14.92
XYZ
  pour Bottom: 2.54,24.92 1.11,24.92 1.11,15.56 2.54,15.56

### Text on the board
tPlace: ~ | ~ | ~ | ~ | ~ | ~ | OLED Display | Vcc | SCL | GND | SDA | SW2 - Pin 3 | SW1 - Pin 2 | Z | X | LED_DO | Y | Legacy | PROX_INT | ACC_INT1 | Shield | ACC_INT2 | 3.3V | GND | 5V | Power
bPlace: Legacy | Shield | Jumpers | Pins Used | Change DPS I2C address | JP1 | 2 | SW1 | Change ACC I2C address | JP2 | 3 | SW2 | Connect SW1 to Pin 2 | J1 | 4 | RGB LED | Connect SW2 to Pin 3 | J2 | Connect RGB LED to Pin 4 | J3 | I2C Address | Sensor | 0x39 | APDS | DPS422 | 0x77 (JP1 open) / 0x76 (JP1 closed) | 0x19 (JP2 open) / 0x18 (JP2 closed) | LIS3DH / (ACC)
bStop: Designed by AP